# Altium project OpAmpNSD.PRJPCB
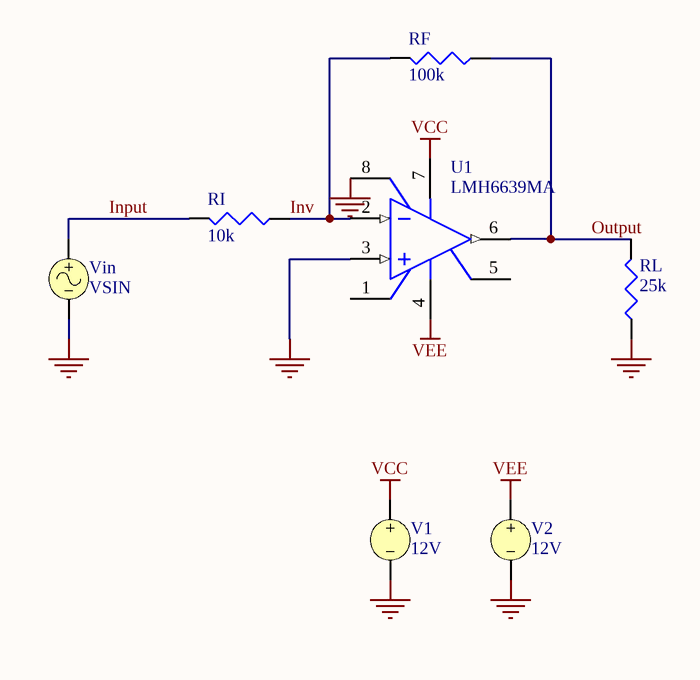
[diagram p0: OpAmpNSD.schdoc]
1 sheet, 7 parts. Net scope: global (net labels, ports and power ports of the same name join across sheets).

## Sheet OpAmpNSD.schdoc: Analog Amplifier
size A4; Organization: Altium Limited; Address1: L3, 12a Rodborough Rd; Address2: Frenchs Forest; Address3: NSW; Address4: Australia 2086; DocumentNumber: 1; SheetNumber: 1; SheetTotal: 1

### Parts
RF  100k
RI  10k
RL  25k
U1  LMH6639MA  [M08A_N]
V1  12V
V2  value 12V  (hidden comment: -12V)
Vin  VSIN

### Nets
GND: RL.2(BOT) U1.3(IN+) U1.8(~{SD}) V1.2 V2.2 Vin.2
VCC: U1.7(V+) V1.1
VEE: U1.4(V-) V2.1
Input: RI.1(TOP) Vin.1
Inv: RF.1(TOP) RI.2(BOT) U1.2(IN-)
Output: RF.2(BOT) RL.1(TOP) U1.6(OUT)

Not connected (* = marked no-connect by the designer): U1 1(NC) 5(NC)

### Notes on the sheet
- Title
- Size:
- Date:
- A4
- Number:
- Time:
- Revision:
- Sheet
- of
- File:

### Library data of the parts
RF RI RL = RES: Resistor
  RF: Value: 100k
  RI: Value: 10k
  RL: Value: 25k
U1 = LMH6639MA: 190MHz Rail-to-Rail Output Amplifier with Disable; Manufacturer: National Semiconductor; CompType: Amplifiers; PackageTopMarking: NSZXTT*LMH66*39MA; Published: 4-Dec-2008; DatasheetVersion: Dec-2004; PackageVersion: revL, Sep-2006; PackageReference: M08A; Publisher: Altium Limited; PackageDescription: SOIC Narrow, 4.9 x 3.9 x 1.45mm, 8 Lead, 1.27mm Pitch; PartNumber: LMH6639MA; RoHS: Y; PinCount: 8; DigiKeyPartNumber: LMH6639MA-ND; Code_JEDEC: MS-012-AA; Code_IPC: SOIC127P600-8; ComponentLink1Description: LMH6639 Datasheet; ComponentLink1URL: http://www.national.com/ds/LM/LMH6639.pdf; ComponentLink2Description: LMH6639 Web Page; ComponentLink2URL: http://www.national.com/pf/LM/LMH6639.html; ComponentLink3Description: M08A Package Page; ComponentLink3URL: http://www.national.com/packaging/folders/m08a.html; DeviceFunction: Amplifier
V1 V2 = VSRC: Voltage Source
  V1: Value: 12V
Vin = VSIN: Sinusoidal Voltage Source